# Altium schematic sheet MCU.SchDoc
size A4
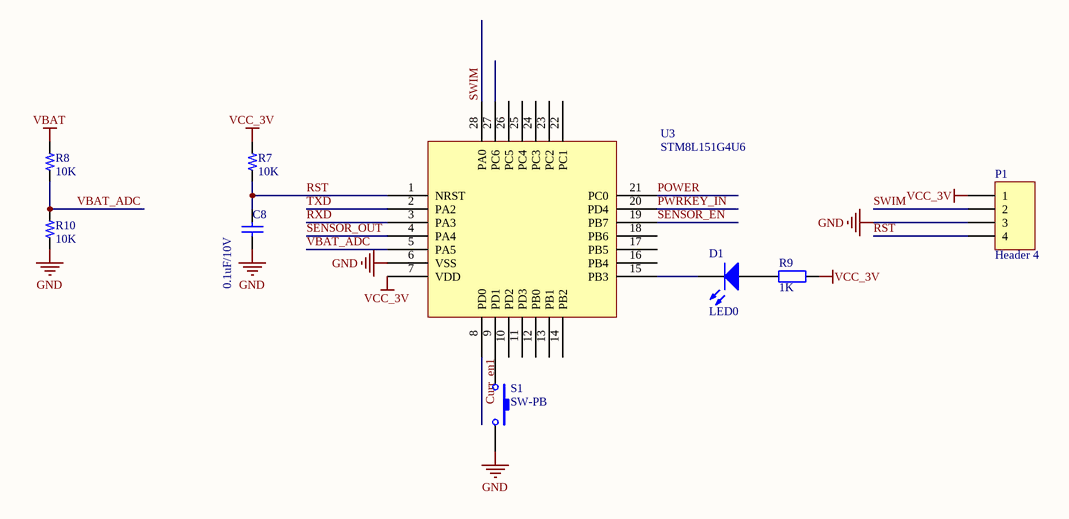
[diagram p0: MCU.SchDoc]

## Parts
C8  0.1uF/10V  [0603C]
D1  LED0  [0603LED]
P1  Header 4  [HDR1X4]
R7  10K  [0603R]
R8  10K  [0603R]
R9  1K  [0603R]
R10  10K  [0603R]
S1  SW-PB  [key]
U3  STM8L151G4U6  [UFQFPN28]

## Nets
GND: C8.2 P1.3 R10.1 S1.2 U3.6(VSS)
VBAT: R8.2
VCC_3V: P1.1 R7.2 R9.1 U3.7(VDD)
Curr_en1: U3.8(PD0)
POWER: U3.21(PC0)
PWRKEY_IN: U3.20(PD4)
RST: C8.1 P1.4 R7.1 U3.1(NRST)
RXD: U3.3(PA3)
SENSOR_EN: U3.19(PB7)
SENSOR_OUT: U3.4(PA4)
SWIM: P1.2 U3.28(PA0)
TXD: U3.2(PA2)
VBAT_ADC: R8.1 R10.2 U3.5(PA5)
NetD1_1: D1.1(A) R9.2
NetD1_2: D1.2(K) U3.15(PB3)
NetS1_1: S1.1 U3.9(PD1)

Not connected (* = marked no-connect by the designer): U3 10(PD2) 11(PD3) 12(PB0) 13(PB1) 14(PB2) 16(PB4) 17(PB5) 18(PB6) 22(PC1) 23(PC2) 24(PC3) 25(PC4) 26(PC5) 27(PC6)

## Library data of the parts
C8 = Cap: Capacitor; Value: 104; Published: 8-Jun-2000; LatestRevisionDate: 17-Jul-2002; LatestRevisionNote: Re-released for DXP Platform.; PackageReference: RAD-0.3; Publisher: Altium Limited
D1 = LED0: Typical INFRARED GaAs LED; Published: 8-Jun-2000; LatestRevisionDate: 08-Jul-2005; LatestRevisionNote: Mech Layer 1 removed.; PackageReference: LED-0; Publisher: Altium Limited
P1 = Header 4: Header, 4-Pin; LatestRevisionDate: 17-Jul-2002; LatestRevisionNote: Re-released for DXP Platform.; Publisher: Altium Limited
R7 R8 R10 = R
R9 = Res2: Resistor; Published: 8-Jun-2000; LatestRevisionDate: 17-Jul-2002; LatestRevisionNote: Re-released for DXP Platform.; PackageReference: AXIAL-0.4; Publisher: Altium Limited; Value: 1K
S1 = SW-PB: Switch; Published: 24-Mar-1999; LatestRevisionDate: 17-Jul-2002; LatestRevisionNote: Re-released for DXP Platform.; PackageReference: SPST-2; Publisher: Altium Limited